# Altium schematic sheet DC309A_TXOUT.SchDoc: TXOUT
size 558 x 431 mm; Date: Not shown in title block; ApprovedBy: Not shown in title block; CheckedBy: Not shown in title block; Author: Not shown in title block; CompanyName: Not shown in title block; DrawnBy: KAVIKANNAN; Engineer: Not shown in title block; Organization: Not shown in title block; Address1: Not shown in title block; Address2: Not shown in title block; Address3: Not shown in title block; Address4: Not shown in title block; DocumentNumber: 4; Revision: Use project parameter SCH_Rev; SheetNumber: 4; SheetTotal: 11; PageSetup: Record=PageOptions|CenterHorizontal=True|CenterVertical=True|PrintScale=1.00|XCorrection=1.00|YCorrection=1.00|PrintKind=0|BorderSize=5000000|LeftOffset=0|BottomOffset=0|Orientation=2|PaperLength=1000|PaperWidth=1000|Scale=100|PaperSource=15|PrintQuality=600|MediaType=1|DitherType=10|PaperKind=Letter|PrintScaleMode=1; CurrentTime: Not shown in title block; CurrentDate: Not shown in title block; Time: Not shown in title block; DocumentFullPathAndName: Not shown in title block; DocumentName: Not shown in title block; ModifiedDate: Not shown in title block; ImagePath: Not shown in title block
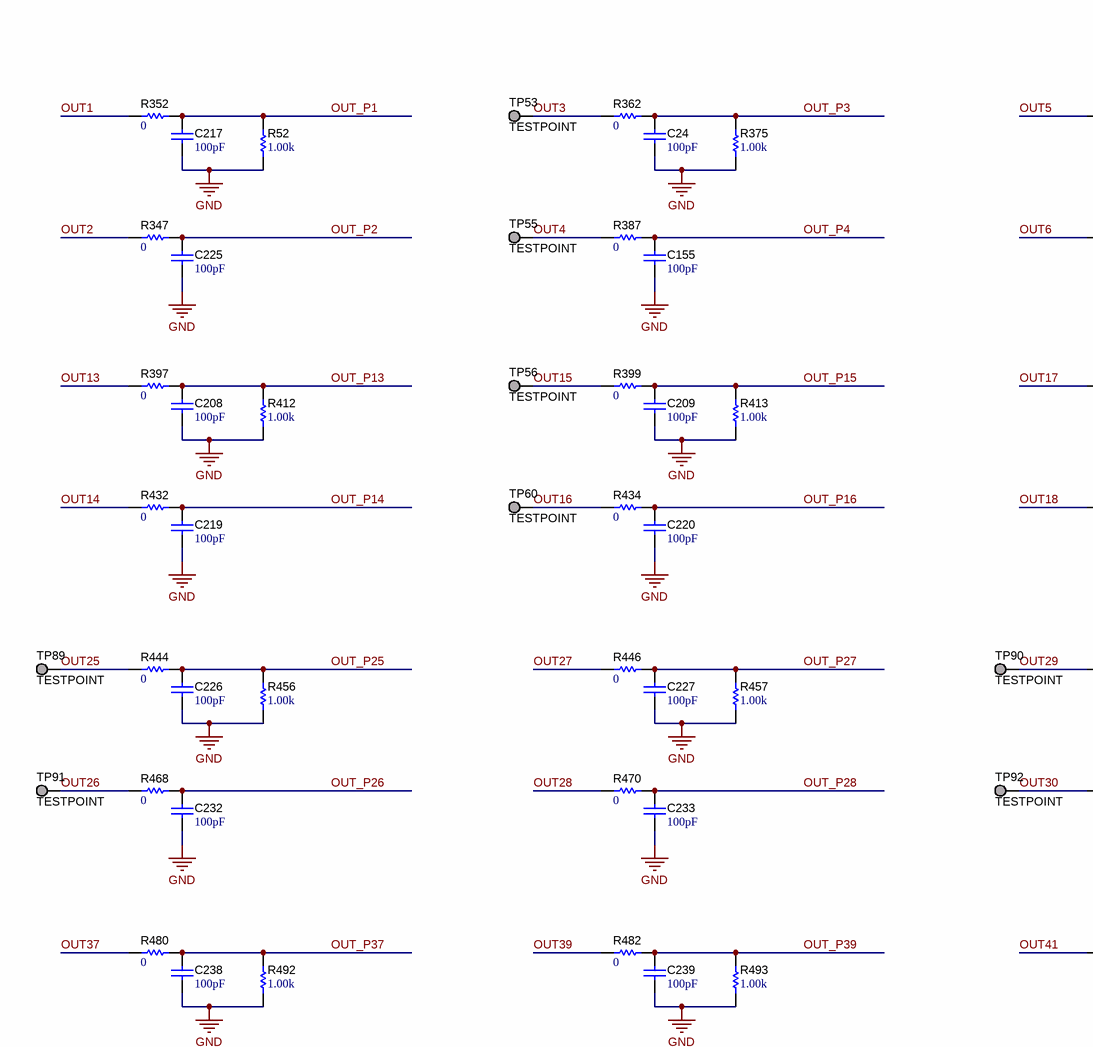
[diagram p0: DC309A_TXOUT.SchDoc, top left]
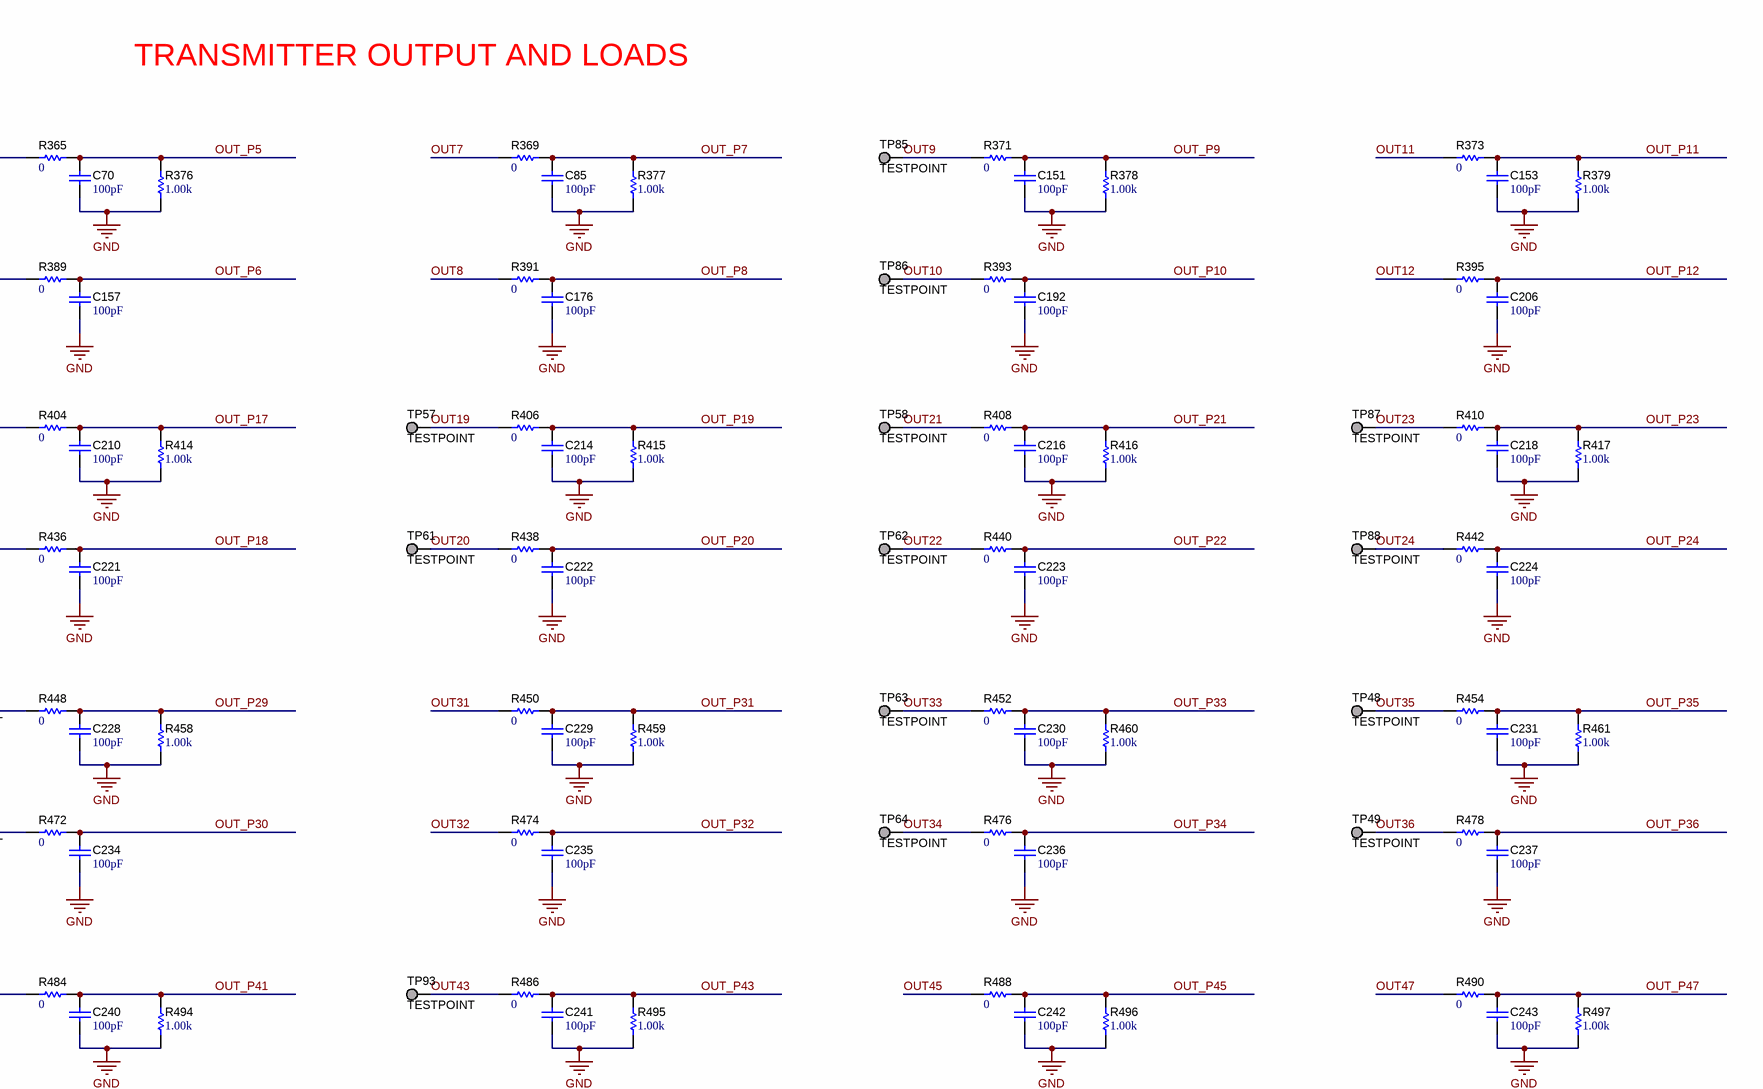
[diagram p1: DC309A_TXOUT.SchDoc, top right]
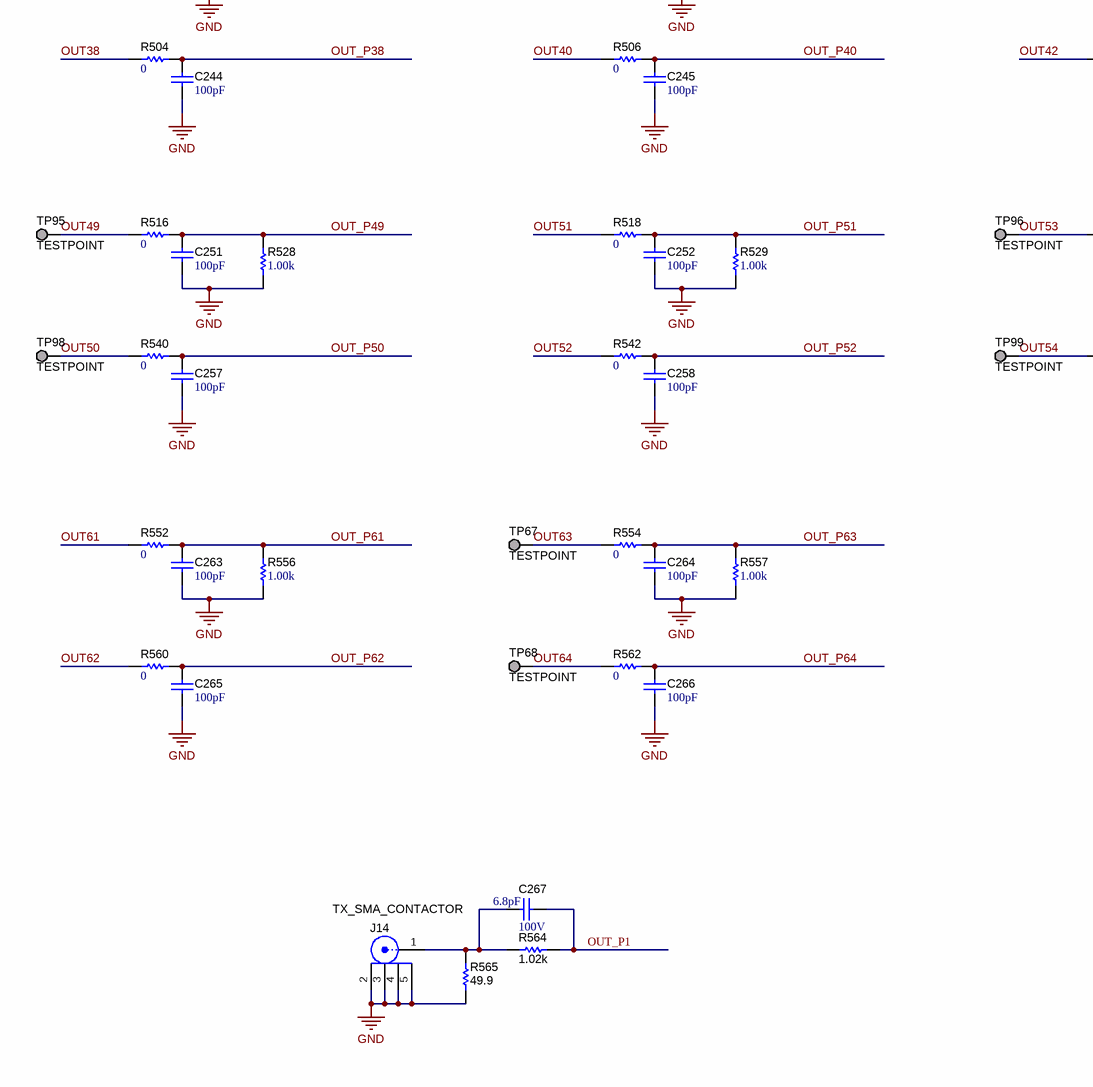
[diagram p2: DC309A_TXOUT.SchDoc, bottom left]
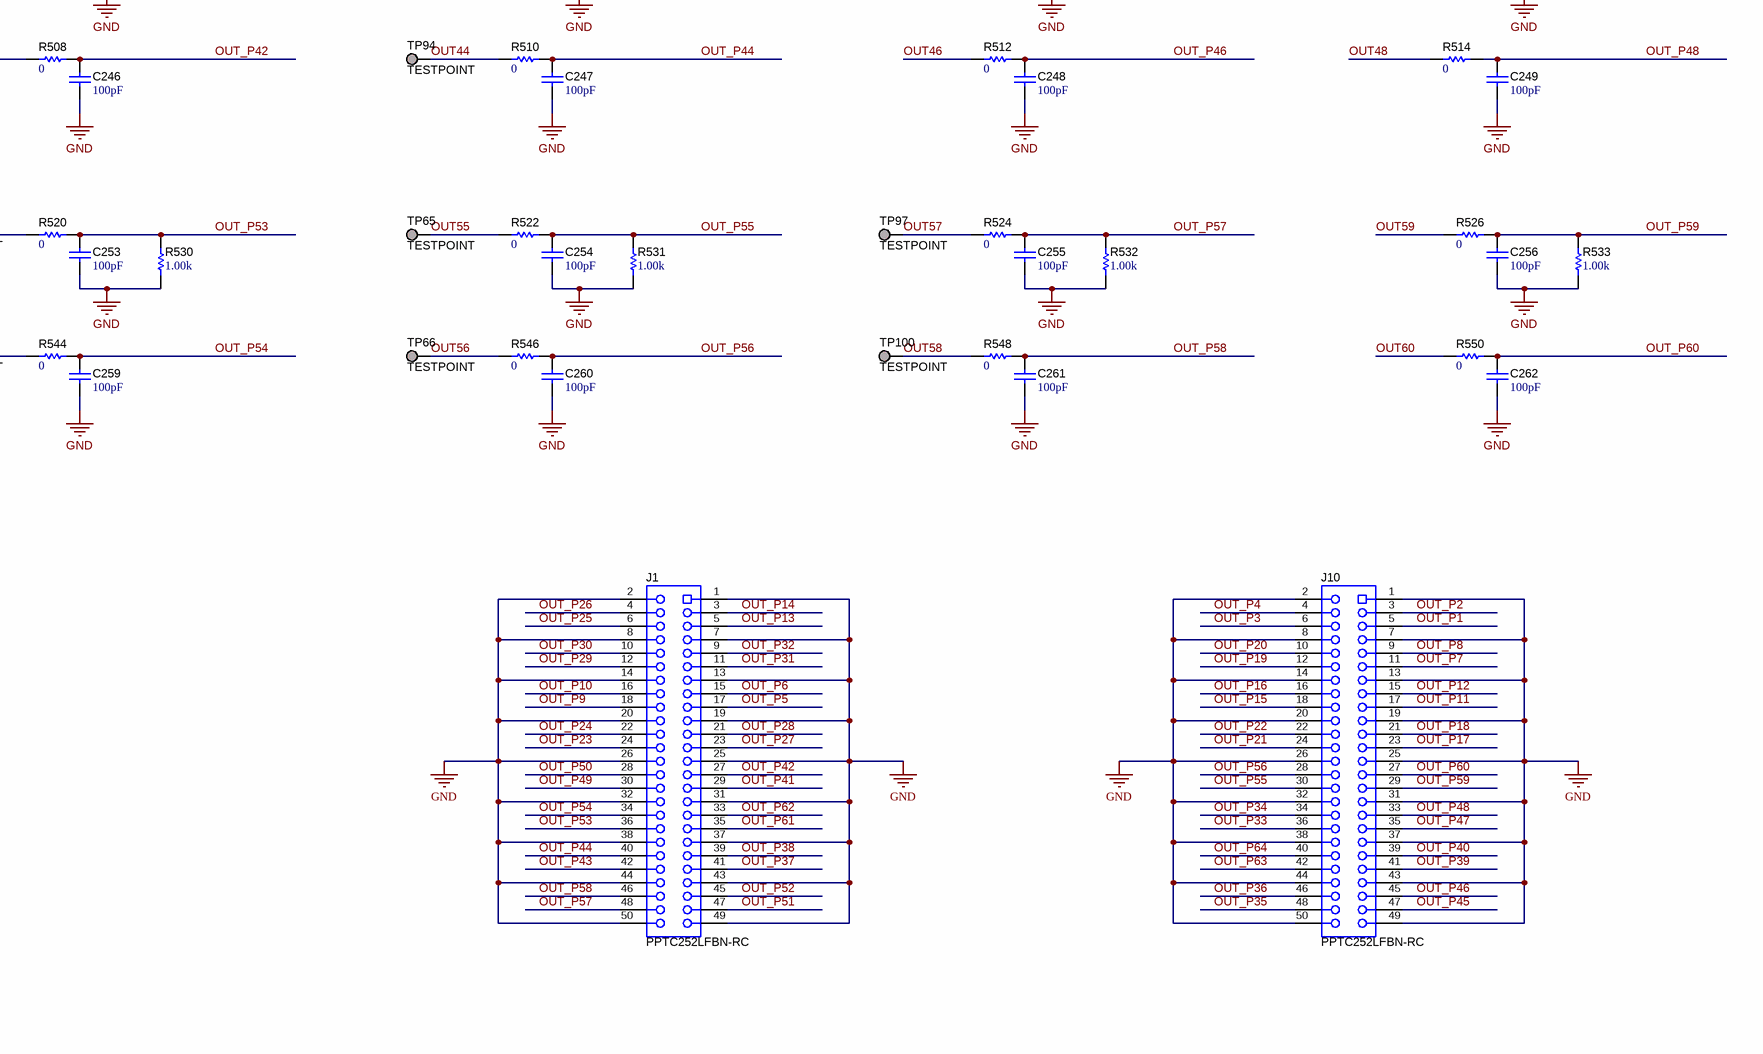
[diagram p3: DC309A_TXOUT.SchDoc, bottom right]

## Parts
C24  ValueDisplayed: 100pF  [0603]  (hidden comment: AC0603JRNPOYBN101)
C70  ValueDisplayed: 100pF  [0603]  (hidden comment: AC0603JRNPOYBN101)
C85  ValueDisplayed: 100pF  [0603]  (hidden comment: AC0603JRNPOYBN101)
C151  ValueDisplayed: 100pF  [0603]  (hidden comment: AC0603JRNPOYBN101)
C153  ValueDisplayed: 100pF  [0603]  (hidden comment: AC0603JRNPOYBN101)
C155  ValueDisplayed: 100pF  [0603]  (hidden comment: AC0603JRNPOYBN101)
C157  ValueDisplayed: 100pF  [0603]  (hidden comment: AC0603JRNPOYBN101)
C176  ValueDisplayed: 100pF  [0603]  (hidden comment: AC0603JRNPOYBN101)
C192  ValueDisplayed: 100pF  [0603]  (hidden comment: AC0603JRNPOYBN101)
C206  ValueDisplayed: 100pF  [0603]  (hidden comment: AC0603JRNPOYBN101)
C208  ValueDisplayed: 100pF  [0603]  (hidden comment: AC0603JRNPOYBN101)
C209  ValueDisplayed: 100pF  [0603]  (hidden comment: AC0603JRNPOYBN101)
C210  ValueDisplayed: 100pF  [0603]  (hidden comment: AC0603JRNPOYBN101)
C214  ValueDisplayed: 100pF  [0603]  (hidden comment: AC0603JRNPOYBN101)
C216  ValueDisplayed: 100pF  [0603]  (hidden comment: AC0603JRNPOYBN101)
C217  ValueDisplayed: 100pF  [0603]  (hidden comment: AC0603JRNPOYBN101)
C218  ValueDisplayed: 100pF  [0603]  (hidden comment: AC0603JRNPOYBN101)
C219  ValueDisplayed: 100pF  [0603]  (hidden comment: AC0603JRNPOYBN101)
C220  ValueDisplayed: 100pF  [0603]  (hidden comment: AC0603JRNPOYBN101)
C221  ValueDisplayed: 100pF  [0603]  (hidden comment: AC0603JRNPOYBN101)
C222  ValueDisplayed: 100pF  [0603]  (hidden comment: AC0603JRNPOYBN101)
C223  ValueDisplayed: 100pF  [0603]  (hidden comment: AC0603JRNPOYBN101)
C224  ValueDisplayed: 100pF  [0603]  (hidden comment: AC0603JRNPOYBN101)
C225  ValueDisplayed: 100pF  [0603]  (hidden comment: AC0603JRNPOYBN101)
C226  ValueDisplayed: 100pF  [0603]  (hidden comment: AC0603JRNPOYBN101)
C227  ValueDisplayed: 100pF  [0603]  (hidden comment: AC0603JRNPOYBN101)
C228  ValueDisplayed: 100pF  [0603]  (hidden comment: AC0603JRNPOYBN101)
C229  ValueDisplayed: 100pF  [0603]  (hidden comment: AC0603JRNPOYBN101)
C230  ValueDisplayed: 100pF  [0603]  (hidden comment: AC0603JRNPOYBN101)
C231  ValueDisplayed: 100pF  [0603]  (hidden comment: AC0603JRNPOYBN101)
C232  ValueDisplayed: 100pF  [0603]  (hidden comment: AC0603JRNPOYBN101)
C233  ValueDisplayed: 100pF  [0603]  (hidden comment: AC0603JRNPOYBN101)
C234  ValueDisplayed: 100pF  [0603]  (hidden comment: AC0603JRNPOYBN101)
C235  ValueDisplayed: 100pF  [0603]  (hidden comment: AC0603JRNPOYBN101)
C236  ValueDisplayed: 100pF  [0603]  (hidden comment: AC0603JRNPOYBN101)
C237  ValueDisplayed: 100pF  [0603]  (hidden comment: AC0603JRNPOYBN101)
C238  ValueDisplayed: 100pF  [0603]  (hidden comment: AC0603JRNPOYBN101)
C239  ValueDisplayed: 100pF  [0603]  (hidden comment: AC0603JRNPOYBN101)
C240  ValueDisplayed: 100pF  [0603]  (hidden comment: AC0603JRNPOYBN101)
C241  ValueDisplayed: 100pF  [0603]  (hidden comment: AC0603JRNPOYBN101)
C242  ValueDisplayed: 100pF  [0603]  (hidden comment: AC0603JRNPOYBN101)
C243  ValueDisplayed: 100pF  [0603]  (hidden comment: AC0603JRNPOYBN101)
C244  ValueDisplayed: 100pF  [0603]  (hidden comment: AC0603JRNPOYBN101)
C245  ValueDisplayed: 100pF  [0603]  (hidden comment: AC0603JRNPOYBN101)
C246  ValueDisplayed: 100pF  [0603]  (hidden comment: AC0603JRNPOYBN101)
C247  ValueDisplayed: 100pF  [0603]  (hidden comment: AC0603JRNPOYBN101)
C248  ValueDisplayed: 100pF  [0603]  (hidden comment: AC0603JRNPOYBN101)
C249  ValueDisplayed: 100pF  [0603]  (hidden comment: AC0603JRNPOYBN101)
C251  ValueDisplayed: 100pF  [0603]  (hidden comment: AC0603JRNPOYBN101)
C252  ValueDisplayed: 100pF  [0603]  (hidden comment: AC0603JRNPOYBN101)
C253  ValueDisplayed: 100pF  [0603]  (hidden comment: AC0603JRNPOYBN101)
C254  ValueDisplayed: 100pF  [0603]  (hidden comment: AC0603JRNPOYBN101)
C255  ValueDisplayed: 100pF  [0603]  (hidden comment: AC0603JRNPOYBN101)
C256  ValueDisplayed: 100pF  [0603]  (hidden comment: AC0603JRNPOYBN101)
C257  ValueDisplayed: 100pF  [0603]  (hidden comment: AC0603JRNPOYBN101)
C258  ValueDisplayed: 100pF  [0603]  (hidden comment: AC0603JRNPOYBN101)
C259  ValueDisplayed: 100pF  [0603]  (hidden comment: AC0603JRNPOYBN101)
C260  ValueDisplayed: 100pF  [0603]  (hidden comment: AC0603JRNPOYBN101)
C261  ValueDisplayed: 100pF  [0603]  (hidden comment: AC0603JRNPOYBN101)
C262  ValueDisplayed: 100pF  [0603]  (hidden comment: AC0603JRNPOYBN101)
C263  ValueDisplayed: 100pF  [0603]  (hidden comment: AC0603JRNPOYBN101)
C264  ValueDisplayed: 100pF  [0603]  (hidden comment: AC0603JRNPOYBN101)
C265  ValueDisplayed: 100pF  [0603]  (hidden comment: AC0603JRNPOYBN101)
C266  ValueDisplayed: 100pF  [0603]  (hidden comment: AC0603JRNPOYBN101)
C267  VDC_V: 100V  ValueDisplayed: 6.8pF  [0603]  (hidden comment: CC0603CRNPO0BN6R8)
J1  PPTC252LFBN-RC  [Sullins_xPxC252LFBN]
J10  PPTC252LFBN-RC  [Sullins_xPxC252LFBN]
J14  901-144-8RFX  [AMPHENOL_901-144-8RFX]  (value not drawn)
R52  ValueDisplayed: 1.00k  [2512]  (hidden comment: CRCW25121K00FKEG)
R347  ValueDisplayed: 0  [5106]  (hidden comment: 5106)
R352  ValueDisplayed: 0  [5106]  (hidden comment: 5106)
R362  ValueDisplayed: 0  [5106]  (hidden comment: 5106)
R365  ValueDisplayed: 0  [5106]  (hidden comment: 5106)
R369  ValueDisplayed: 0  [5106]  (hidden comment: 5106)
R371  ValueDisplayed: 0  [5106]  (hidden comment: 5106)
R373  ValueDisplayed: 0  [5106]  (hidden comment: 5106)
R375  ValueDisplayed: 1.00k  [2512]  (hidden comment: CRCW25121K00FKEG)
R376  ValueDisplayed: 1.00k  [2512]  (hidden comment: CRCW25121K00FKEG)
R377  ValueDisplayed: 1.00k  [2512]  (hidden comment: CRCW25121K00FKEG)
R378  ValueDisplayed: 1.00k  [2512]  (hidden comment: CRCW25121K00FKEG)
R379  ValueDisplayed: 1.00k  [2512]  (hidden comment: CRCW25121K00FKEG)
R387  ValueDisplayed: 0  [5106]  (hidden comment: 5106)
R389  ValueDisplayed: 0  [5106]  (hidden comment: 5106)
R391  ValueDisplayed: 0  [5106]  (hidden comment: 5106)
R393  ValueDisplayed: 0  [5106]  (hidden comment: 5106)
R395  ValueDisplayed: 0  [5106]  (hidden comment: 5106)
R397  ValueDisplayed: 0  [5106]  (hidden comment: 5106)
R399  ValueDisplayed: 0  [5106]  (hidden comment: 5106)
R404  ValueDisplayed: 0  [5106]  (hidden comment: 5106)
R406  ValueDisplayed: 0  [5106]  (hidden comment: 5106)
R408  ValueDisplayed: 0  [5106]  (hidden comment: 5106)
R410  ValueDisplayed: 0  [5106]  (hidden comment: 5106)
R412  ValueDisplayed: 1.00k  [2512]  (hidden comment: CRCW25121K00FKEG)
R413  ValueDisplayed: 1.00k  [2512]  (hidden comment: CRCW25121K00FKEG)
R414  ValueDisplayed: 1.00k  [2512]  (hidden comment: CRCW25121K00FKEG)
R415  ValueDisplayed: 1.00k  [2512]  (hidden comment: CRCW25121K00FKEG)
R416  ValueDisplayed: 1.00k  [2512]  (hidden comment: CRCW25121K00FKEG)
R417  ValueDisplayed: 1.00k  [2512]  (hidden comment: CRCW25121K00FKEG)
R432  ValueDisplayed: 0  [5106]  (hidden comment: 5106)
R434  ValueDisplayed: 0  [5106]  (hidden comment: 5106)
R436  ValueDisplayed: 0  [5106]  (hidden comment: 5106)
R438  ValueDisplayed: 0  [5106]  (hidden comment: 5106)
R440  ValueDisplayed: 0  [5106]  (hidden comment: 5106)
R442  ValueDisplayed: 0  [5106]  (hidden comment: 5106)
R444  ValueDisplayed: 0  [5106]  (hidden comment: 5106)
R446  ValueDisplayed: 0  [5106]  (hidden comment: 5106)
R448  ValueDisplayed: 0  [5106]  (hidden comment: 5106)
R450  ValueDisplayed: 0  [5106]  (hidden comment: 5106)
R452  ValueDisplayed: 0  [5106]  (hidden comment: 5106)
R454  ValueDisplayed: 0  [5106]  (hidden comment: 5106)
R456  ValueDisplayed: 1.00k  [2512]  (hidden comment: CRCW25121K00FKEG)
R457  ValueDisplayed: 1.00k  [2512]  (hidden comment: CRCW25121K00FKEG)
R458  ValueDisplayed: 1.00k  [2512]  (hidden comment: CRCW25121K00FKEG)
R459  ValueDisplayed: 1.00k  [2512]  (hidden comment: CRCW25121K00FKEG)
R460  ValueDisplayed: 1.00k  [2512]  (hidden comment: CRCW25121K00FKEG)
R461  ValueDisplayed: 1.00k  [2512]  (hidden comment: CRCW25121K00FKEG)
R468  ValueDisplayed: 0  [5106]  (hidden comment: 5106)
R470  ValueDisplayed: 0  [5106]  (hidden comment: 5106)
R472  ValueDisplayed: 0  [5106]  (hidden comment: 5106)
R474  ValueDisplayed: 0  [5106]  (hidden comment: 5106)
R476  ValueDisplayed: 0  [5106]  (hidden comment: 5106)
R478  ValueDisplayed: 0  [5106]  (hidden comment: 5106)
R480  ValueDisplayed: 0  [5106]  (hidden comment: 5106)
R482  ValueDisplayed: 0  [5106]  (hidden comment: 5106)
R484  ValueDisplayed: 0  [5106]  (hidden comment: 5106)
R486  ValueDisplayed: 0  [5106]  (hidden comment: 5106)
R488  ValueDisplayed: 0  [5106]  (hidden comment: 5106)
R490  ValueDisplayed: 0  [5106]  (hidden comment: 5106)
R492  ValueDisplayed: 1.00k  [2512]  (hidden comment: CRCW25121K00FKEG)
R493  ValueDisplayed: 1.00k  [2512]  (hidden comment: CRCW25121K00FKEG)
R494  ValueDisplayed: 1.00k  [2512]  (hidden comment: CRCW25121K00FKEG)
R495  ValueDisplayed: 1.00k  [2512]  (hidden comment: CRCW25121K00FKEG)
R496  ValueDisplayed: 1.00k  [2512]  (hidden comment: CRCW25121K00FKEG)
R497  ValueDisplayed: 1.00k  [2512]  (hidden comment: CRCW25121K00FKEG)
R504  ValueDisplayed: 0  [5106]  (hidden comment: 5106)
R506  ValueDisplayed: 0  [5106]  (hidden comment: 5106)
R508  ValueDisplayed: 0  [5106]  (hidden comment: 5106)
R510  ValueDisplayed: 0  [5106]  (hidden comment: 5106)
R512  ValueDisplayed: 0  [5106]  (hidden comment: 5106)
R514  ValueDisplayed: 0  [5106]  (hidden comment: 5106)
R516  ValueDisplayed: 0  [5106]  (hidden comment: 5106)
R518  ValueDisplayed: 0  [5106]  (hidden comment: 5106)
R520  ValueDisplayed: 0  [5106]  (hidden comment: 5106)
R522  ValueDisplayed: 0  [5106]  (hidden comment: 5106)
R524  ValueDisplayed: 0  [5106]  (hidden comment: 5106)
R526  ValueDisplayed: 0  [5106]  (hidden comment: 5106)
R528  ValueDisplayed: 1.00k  [2512]  (hidden comment: CRCW25121K00FKEG)
R529  ValueDisplayed: 1.00k  [2512]  (hidden comment: CRCW25121K00FKEG)
R530  ValueDisplayed: 1.00k  [2512]  (hidden comment: CRCW25121K00FKEG)
R531  ValueDisplayed: 1.00k  [2512]  (hidden comment: CRCW25121K00FKEG)
R532  ValueDisplayed: 1.00k  [2512]  (hidden comment: CRCW25121K00FKEG)
R533  ValueDisplayed: 1.00k  [2512]  (hidden comment: CRCW25121K00FKEG)
R540  ValueDisplayed: 0  [5106]  (hidden comment: 5106)
R542  ValueDisplayed: 0  [5106]  (hidden comment: 5106)
R544  ValueDisplayed: 0  [5106]  (hidden comment: 5106)
R546  ValueDisplayed: 0  [5106]  (hidden comment: 5106)
R548  ValueDisplayed: 0  [5106]  (hidden comment: 5106)
R550  ValueDisplayed: 0  [5106]  (hidden comment: 5106)
R552  ValueDisplayed: 0  [5106]  (hidden comment: 5106)
R554  ValueDisplayed: 0  [5106]  (hidden comment: 5106)
R556  ValueDisplayed: 1.00k  [2512]  (hidden comment: CRCW25121K00FKEG)
R557  ValueDisplayed: 1.00k  [2512]  (hidden comment: CRCW25121K00FKEG)
R560  ValueDisplayed: 0  [5106]  (hidden comment: 5106)
R562  ValueDisplayed: 0  [5106]  (hidden comment: 5106)
R564  ValueDisplayed: 1.02k  [1206]  (hidden comment: Resistor)
R565  ValueDisplayed: 49.9  [TNPW0603]  (hidden comment: TNPW060349R9BEEA)
TP48  TESTPOINT  [TP_50MIL-SMT]  (no BOM)
TP49  TESTPOINT  [TP_50MIL-SMT]  (no BOM)
TP53  TESTPOINT  [TP_50MIL-SMT]  (no BOM)
TP55  TESTPOINT  [TP_50MIL-SMT]  (no BOM)
TP56  TESTPOINT  [TP_50MIL-SMT]  (no BOM)
TP57  TESTPOINT  [TP_50MIL-SMT]  (no BOM)
TP58  TESTPOINT  [TP_50MIL-SMT]  (no BOM)
TP60  TESTPOINT  [TP_50MIL-SMT]  (no BOM)
TP61  TESTPOINT  [TP_50MIL-SMT]  (no BOM)
TP62  TESTPOINT  [TP_50MIL-SMT]  (no BOM)
TP63  TESTPOINT  [TP_50MIL-SMT]  (no BOM)
TP64  TESTPOINT  [TP_50MIL-SMT]  (no BOM)
TP65  TESTPOINT  [TP_50MIL-SMT]  (no BOM)
TP66  TESTPOINT  [TP_50MIL-SMT]  (no BOM)
TP67  TESTPOINT  [TP_50MIL-SMT]  (no BOM)
TP68  TESTPOINT  [TP_50MIL-SMT]  (no BOM)
TP85  TESTPOINT  [TP_50MIL-SMT]  (no BOM)
TP86  TESTPOINT  [TP_50MIL-SMT]  (no BOM)
TP87  TESTPOINT  [TP_50MIL-SMT]  (no BOM)
TP88  TESTPOINT  [TP_50MIL-SMT]  (no BOM)
TP89  TESTPOINT  [TP_50MIL-SMT]  (no BOM)
TP90  TESTPOINT  [TP_50MIL-SMT]  (no BOM)
TP91  TESTPOINT  [TP_50MIL-SMT]  (no BOM)
TP92  TESTPOINT  [TP_50MIL-SMT]  (no BOM)
TP93  TESTPOINT  [TP_50MIL-SMT]  (no BOM)
TP94  TESTPOINT  [TP_50MIL-SMT]  (no BOM)
TP95  TESTPOINT  [TP_50MIL-SMT]  (no BOM)
TP96  TESTPOINT  [TP_50MIL-SMT]  (no BOM)
TP97  TESTPOINT  [TP_50MIL-SMT]  (no BOM)
TP98  TESTPOINT  [TP_50MIL-SMT]  (no BOM)
TP99  TESTPOINT  [TP_50MIL-SMT]  (no BOM)
TP100  TESTPOINT  [TP_50MIL-SMT]  (no BOM)

## Nets
GND: C24.2 C70.2 C85.2 C151.2 C153.2 C155.2 C157.2 C176.2 C192.2 C206.2 C208.2 C209.2 C210.2 C214.2 C216.2 C217.2 C218.2 C219.2 C220.2 C221.2 C222.2 C223.2 C224.2 C225.2 C226.2 C227.2 C228.2 C229.2 C230.2 C231.2 C232.2 C233.2 C234.2 C235.2 C236.2 C237.2 C238.2 C239.2 C240.2 C241.2 C242.2 C243.2 C244.2 C245.2 C246.2 C247.2 C248.2 C249.2 C251.2 C252.2 C253.2 C254.2 C255.2 C256.2 C257.2 C258.2 C259.2 C260.2 C261.2 C262.2 C263.2 C264.2 C265.2 C266.2 J1.1 J1.2 J1.7 J1.8 J1.13 J1.14 J1.19 J1.20 J1.25 J1.26 J1.31 J1.32 J1.37 J1.38 J1.43 J1.44 J1.49 J1.50 J10.1 J10.2 J10.7 J10.8 J10.13 J10.14 J10.19 J10.20 J10.25 J10.26 J10.31 J10.32 J10.37 J10.38 J10.43 J10.44 J10.49 J10.50 J14.2 J14.3 J14.4 J14.5 R52.1 R375.1 R376.1 R377.1 R378.1 R379.1 R412.1 R413.1 R414.1 R415.1 R416.1 R417.1 R456.1 R457.1 R458.1 R459.1 R460.1 R461.1 R492.1 R493.1 R494.1 R495.1 R496.1 R497.1 R528.1 R529.1 R530.1 R531.1 R532.1 R533.1 R556.1 R557.1 R565.1
OUT1: R352.1
OUT2: R347.1
OUT3: R362.1 TP53.1
OUT4: R387.1 TP55.1
OUT5: R365.1
OUT6: R389.1
OUT7: R369.1
OUT8: R391.1
OUT9: R371.1 TP85.1
OUT10: R393.1 TP86.1
OUT11: R373.1
OUT12: R395.1
OUT13: R397.1
OUT14: R432.1
OUT15: R399.1 TP56.1
OUT16: R434.1 TP60.1
OUT17: R404.1
OUT18: R436.1
OUT19: R406.1 TP57.1
OUT20: R438.1 TP61.1
OUT21: R408.1 TP58.1
OUT22: R440.1 TP62.1
OUT23: R410.1 TP87.1
OUT24: R442.1 TP88.1
OUT25: R444.1 TP89.1
OUT26: R468.1 TP91.1
OUT27: R446.1
OUT28: R470.1
OUT29: R448.1 TP90.1
OUT30: R472.1 TP92.1
OUT31: R450.1
OUT32: R474.1
OUT33: R452.1 TP63.1
OUT34: R476.1 TP64.1
OUT35: R454.1 TP48.1
OUT36: R478.1 TP49.1
OUT37: R480.1
OUT38: R504.1
OUT39: R482.1
OUT40: R506.1
OUT41: R484.1
OUT42: R508.1
OUT43: R486.1 TP93.1
OUT44: R510.1 TP94.1
OUT45: R488.1
OUT46: R512.1
OUT47: R490.1
OUT48: R514.1
OUT49: R516.1 TP95.1
OUT50: R540.1 TP98.1
OUT51: R518.1
OUT52: R542.1
OUT53: R520.1 TP96.1
OUT54: R544.1 TP99.1
OUT55: R522.1 TP65.1
OUT56: R546.1 TP66.1
OUT57: R524.1 TP97.1
OUT58: R548.1 TP100.1
OUT59: R526.1
OUT60: R550.1
OUT61: R552.1
OUT62: R560.1
OUT63: R554.1 TP67.1
OUT64: R562.1 TP68.1
OUT_P1: C217.1 C267.1 J10.5 R52.2 R352.2 R564.2
OUT_P2: C225.1 J10.3 R347.2
OUT_P3: C24.1 J10.6 R362.2 R375.2
OUT_P4: C155.1 J10.4 R387.2
OUT_P5: C70.1 J1.17 R365.2 R376.2
OUT_P6: C157.1 J1.15 R389.2
OUT_P7: C85.1 J10.11 R369.2 R377.2
OUT_P8: C176.1 J10.9 R391.2
OUT_P9: C151.1 J1.18 R371.2 R378.2
OUT_P10: C192.1 J1.16 R393.2
OUT_P11: C153.1 J10.17 R373.2 R379.2
OUT_P12: C206.1 J10.15 R395.2
OUT_P13: C208.1 J1.5 R397.2 R412.2
OUT_P14: C219.1 J1.3 R432.2
OUT_P15: C209.1 J10.18 R399.2 R413.2
OUT_P16: C220.1 J10.16 R434.2
OUT_P17: C210.1 J10.23 R404.2 R414.2
OUT_P18: C221.1 J10.21 R436.2
OUT_P19: C214.1 J10.12 R406.2 R415.2
OUT_P20: C222.1 J10.10 R438.2
OUT_P21: C216.1 J10.24 R408.2 R416.2
OUT_P22: C223.1 J10.22 R440.2
OUT_P23: C218.1 J1.24 R410.2 R417.2
OUT_P24: C224.1 J1.22 R442.2
OUT_P25: C226.1 J1.6 R444.2 R456.2
OUT_P26: C232.1 J1.4 R468.2
OUT_P27: C227.1 J1.23 R446.2 R457.2
OUT_P28: C233.1 J1.21 R470.2
OUT_P29: C228.1 J1.12 R448.2 R458.2
OUT_P30: C234.1 J1.10 R472.2
OUT_P31: C229.1 J1.11 R450.2 R459.2
OUT_P32: C235.1 J1.9 R474.2
OUT_P33: C230.1 J10.36 R452.2 R460.2
OUT_P34: C236.1 J10.34 R476.2
OUT_P35: C231.1 J10.48 R454.2 R461.2
OUT_P36: C237.1 J10.46 R478.2
OUT_P37: C238.1 J1.41 R480.2 R492.2
OUT_P38: C244.1 J1.39 R504.2
OUT_P39: C239.1 J10.41 R482.2 R493.2
OUT_P40: C245.1 J10.39 R506.2
OUT_P41: C240.1 J1.29 R484.2 R494.2
OUT_P42: C246.1 J1.27 R508.2
OUT_P43: C241.1 J1.42 R486.2 R495.2
OUT_P44: C247.1 J1.40 R510.2
OUT_P45: C242.1 J10.47 R488.2 R496.2
OUT_P46: C248.1 J10.45 R512.2
OUT_P47: C243.1 J10.35 R490.2 R497.2
OUT_P48: C249.1 J10.33 R514.2
OUT_P49: C251.1 J1.30 R516.2 R528.2
OUT_P50: C257.1 J1.28 R540.2
OUT_P51: C252.1 J1.47 R518.2 R529.2
OUT_P52: C258.1 J1.45 R542.2
OUT_P53: C253.1 J1.36 R520.2 R530.2
OUT_P54: C259.1 J1.34 R544.2
OUT_P55: C254.1 J10.30 R522.2 R531.2
OUT_P56: C260.1 J10.28 R546.2
OUT_P57: C255.1 J1.48 R524.2 R532.2
OUT_P58: C261.1 J1.46 R548.2
OUT_P59: C256.1 J10.29 R526.2 R533.2
OUT_P60: C262.1 J10.27 R550.2
OUT_P61: C263.1 J1.35 R552.2 R556.2
OUT_P62: C265.1 J1.33 R560.2
OUT_P63: C264.1 J10.42 R554.2 R557.2
OUT_P64: C266.1 J10.40 R562.2
NetC267_2: C267.2 J14.1 R564.1 R565.2

## Notes on the sheet
- TRANSMITTER OUTPUT AND LOADS
- TX_SMA_CONTACTOR
- Drawn By:
- SVN Rev:
- Number:
- TID #:
- Orderable:
- Rev:
- Sheet Title:
- File:
- Project Title:
- Designed for:
- Assembly Variant:
- Mod. Date:
- Sheet:
- Size:
- of
- C
- http://www.ti.com
- Texas Instruments and/or its licensors do not warrant the accuracy or completeness of this specification or any information contained therein. Texas Instruments and/or its licensors do not warrant that this design will meet the specifications, will be suitable for your application or fit for any particular purpose, or will operate in an implementation. Texas Instruments and/or its licensors do not warrant that the design is production worthy. You should completely validate and test your design implementation to confirm the system functionality for your application.
- Engineer:
- Contact:
- © Texas Instruments

## Library data of the parts
C24 C70 C85 C151 C153 C155 C157 C176 C192 C206 C208-C210 C214 C216-C249 C251-C266 = CMP-0860793-1: CAP, CERM, 100 pF, 250 V,+/- 5%, C0G/NP0, AEC-Q200 Grade 1, 0603; Manufacturer: Yageo; Polarized: N; Value: 100pF; U/M: EA; VDC_V: 250V; TaMin_C: -55°C; TaMax_C: 125°C; SizeArea_mm2: 1.28; SizeAreaWB_mm2: 4.68; SizeX_mm: 1.6; SizeY_mm: 0.8; SizeZ_mm: 1; AEC Category: Q200; AEC Qualified: Y; CompType: Capacitor; PartNumber: AC0603JRNPOYBN101; PackageReference: 0603; RoHS: Y; Cap_F: 100pF; Tolerance_%: 5%; Value2: 250V; MountType: SMT; Technology: Ceramic; TempCo: C0G/NP0; Cap_Case: 0603; ComponentLink1Description: Datasheet link; ComponentLink1URL: http://www.yageo.com/documents/recent/UPY-AC_NP0X7R_16V-to-630V_12.pdf; AEC Grade: 1
C267 = CMP-0084374-1: CAP, CERM, 6.8 pF, 100 V,+/- 3.7%, C0G/NP0, 0603; Manufacturer: Yageo; TaMin_C: -55°C; Value: 6.8pF; SizeArea_mm2: 1.28; Polarized: N; TaMax_C: 125°C; SizeZ_mm: 1; U/M: EA; SizeY_mm: 0.8; SizeAreaWB_mm2: 4.68; SizeX_mm: 1.6; AEC Category: Q200; MountType: SMT; PartNumber: CC0603CRNPO0BN6R8; TempCo: C0G/NP0; Cap_Case: 0603; AEC Grade: N/A; CompType: Capacitor; Tolerance_%: 3.7%; RoHS: Y; ComponentLink1Description: Datasheet link; Technology: Ceramic; ComponentLink1URL: http://www.yageo.com/documents/recent/UPY-NP0X7R_MV_100-to-630V_21.pdf; Cap_F: 6.8pF; AEC Qualified: N; PackageReference: 0603; Value2: 100V
J1 J10 = CMP-0054672-1: Receptacle, 2.54mm, 25x2, Tin, TH; Manufacturer: Sullins Connector Solutions; CNHeader: FALSE; Current_A: 3A; Gender: Female; Voltage_V: 250V; CompType: Socket Strip; Row_Count: 2; RowSpacing_mm: 2.54; CT: TRUE; Cert_UL: Y; ComponentLink1URL: http://www.sullinscorp.com/drawings/78_P(N)PxCxxxLFBN-RC,_10492-H.pdf; Publisher: Texas Instruments; Color: Black; RoHS: Y; MountType: TH; Supplier 1: Digi-Key; PackageReference: Receptacle, 2.54mm, 25x2, TH; PinCount: 50; LatestRevisionDate: 26/05/2017; PartNumber: PPTC252LFBN-RC; Orientation: Vertical; ComponentLink1Description: Datasheet URL; Supplier Part Number 1: S7093-ND; Pitch_mm: 2.54; ContactFinish: Tin
J14 = CMP-0055833-1: SMA Straight Jack, Gold, 50 Ohm, TH; Manufacturer: Amphenol RF; CNHeader: FALSE; Green_Lifecycle: Not Set; Green_REACh: Incomplete; CT: TRUE; ComponentLink1URL: http://www.amphenolinfocom.eu/NavData/Drawings/C901-144-8RFX.pdf; Supplier Part Number 2: 34C8151; Publisher: Texas Instruments; Supplier 2: Newark; Supplier Part Number 3: 523-901-144-8RFX; Supplier 3: Mouser; RoHS: Y; MountType: TH; Green_EU RoHS-2: Incomplete; Supplier 1: Digi-Key; Green_EU RoHS: Incomplete; PackageReference: SMA Straight Jack, TH; CompType: SMA; LatestRevisionDate: 26/05/2017; PartNumber: 901-144-8RFX; ComponentLink1Description: Datasheet URL; Supplier Part Number 1: ARFX1231-ND
R52 R375-R379 R412-R417 R456-R461 R492-R497 R528-R533 R556 R557 = CMP-0015500-3: RES, 1.00 k, 1%, 1 W, AEC-Q200 Grade 0, 2512; Manufacturer: Vishay-Dale; Power_W: 1W; TempCo: 100 ppm/C; Value_Code: 1k00; Value: 1.00k; EIA_Code: E96; Res_ohm: 1k; SizeX_mm: 6.3; SizeY_mm: 3.2; SizeZ_mm: 0.71; SizeArea_mm2: 20.16; AEC Qualified: Y; VDC_V: 500V; AEC Grade: 0; AEC Category: Q200; ComponentLink1URL: http://www.vishay.com/docs/20035/dcrcwe3.pdf; RoHS: E; Value1: 1%; MountType: SMT; Supplier 1: Digi-Key; PackageReference: 2512; Tolerance_%: 1%; Value2: 1W; CompType: Resistor; PartNumber: CRCW25121K00FKEG; ComponentLink1Description: Datasheet link; Supplier Part Number 1: 541-1.00KAFCT-ND; Technology: Thick Film
R347 R352 R362 R365 R369 R371 R373 R387 R389 R391 R393 R395 R397 R399 R404 R406 R408 R410 R432 R434 R436 R438 R440 R442 R444 R446 R448 R450 R452 R454 R468 R470 R472 R474 R476 R478 R480 R482 R484 R486 R488 R490 R504 R506 R508 R510 R512 R514 R516 R518 R520 R522 R524 R526 R540 R542 R544 R546 R548 R550 R552 R554 R560 R562 = CMP-0020833-2: RES, 0, 1%, 0.5 W, 0805; Manufacturer: Keystone; Power_W: 500mW; TempCo: ppm/C; U/M: EA; Value: 0; SizeX_mm: 2; SizeY_mm: 1.25; SizeZ_mm: 0.84; Value2: 0.5W; SizeArea_mm2: 2.5; AEC Qualified: N; AEC Category: Q200; Publisher: Texas Instruments; Published: 2008-06-26; Value_Code: 0; RoHS: Y; Value1: 1%; MountType: SMT; Supplier 1: Digi-Key; PackageReference: 0805; Tolerance_%: 1%; Res_ohm: 0; CompType: Resistor; LatestRevisionDate: 2017-03-09; PartNumber: 5106; ComponentLink1Description: Datasheet link; AEC Grade: N/A; Supplier Part Number 1: 36-5106CT-ND; Technology: Metal Element; ComponentLink1URL: http://www.keyelco.com/product-pdf.cfm?p=14039
R564 = CMP-0016688-3: RES, 1.02 k, 1%, 0.25 W, AEC-Q200 Grade 0, 1206; PartNumber: CRCW12061K02FKEA; Manufacturer: Vishay-Dale; Value: 1.02k; Value_Code: 1k02; Power_W: 250mW; Value2: 0.25W; VDC_V: 200V; TempCo: 100 ppm/C; SizeArea_mm2: 5.12; SizeX_mm: 3.2; SizeY_mm: 1.6; SizeZ_mm: 1.35; EIA_Code: E96; AEC Category: Q200; AEC Qualified: Y; AEC Grade: 0; CompType: Resistor; PackageReference: 1206; RoHS: E; Res_ohm: 1.02k; Tolerance_%: 1%; Value1: 1%; MountType: SMT; Technology: Thick Film; ComponentLink1Description: Datasheet link; ComponentLink1URL: http://www.vishay.com/docs/20035/dcrcwe3.pdf; Supplier 1: Digi-Key; Supplier Part Number 1: 541-1.02KFCT-ND; Supplier 2: Newark; Supplier Part Number 2: 53K1782; Supplier 3: Mouser; Supplier Part Number 3: 71-CRCW1206-1.02K-E3
R565 = CMP-0025693-1: RES, 49.9, 0.1%, 0.1 W, AEC-Q200 Grade 1, 0603; Manufacturer: Vishay-Dale; Power_W: 100mW; TempCo: 25 ppm/C; Value_Code: 49R9; U/M: EA; Value: 49.9; EIA_Code: E192; SizeX_mm: 1.6; SizeY_mm: 0.85; SizeZ_mm: 0.55; Value2: 0.1W; SizeArea_mm2: 1.36; AEC Qualified: Y; VDC_V: 75V; AEC Grade: 1; AEC Category: Q200; ComponentLink1URL: http://www.vishay.com/docs/28758/tnpw_e3.pdf; Supplier Part Number 2: 05R4782; Publisher: Texas Instruments; Supplier 2: Newark; Supplier Part Number 3: 71-TNPW060349R9BEEA; Supplier 3: Mouser; Published: 2008-06-26; RoHS: Y; Value1: 0.1%; MountType: SMT; Supplier 1: Digi-Key; PackageReference: 0603; Tolerance_%: 0.1%; Res_ohm: 49.9; CompType: Resistor; LatestRevisionDate: 2017-03-09; PartNumber: TNPW060349R9BEEA; ComponentLink1Description: Datasheet link; Supplier Part Number 1: 541-2031-1-ND; Technology: Thin Film
TP48 TP49 TP53 TP55-TP58 TP60-TP68 TP85-TP100 = CMP-0078143-3: TEST POINT.  No entry in BOM.; PackageReference: N/A; CompType: Testpoint; Manufacturer: N/A; PartNumber: N/A; Library Reference: TESTPOINT